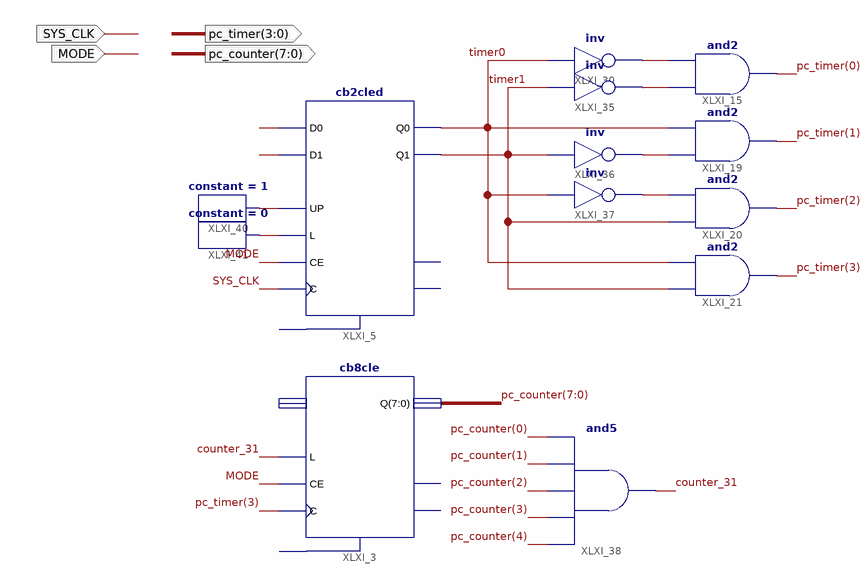
[diagram p0: schematic sheet 1]
// Xilinx ISE schematic programCounter.sch (spartan3e) as structural Verilog: 13 symbols, 4 ports
module programCounter (
  input  SYS_CLK,
  input  MODE,
  output [3:0] pc_timer,
  output [7:0] pc_counter
);

  wire counter_31, timer0, timer1, XLXN_8, XLXN_9, XLXN_11, XLXN_14, XLXN_81, XLXN_83, XLXN_85, XLXN_86;

  cb2cled XLXI_5 (
    .C(SYS_CLK), .CE(MODE), .D0(XLXN_8), .D1(XLXN_9), .L(XLXN_11), .UP(XLXN_14), .Q0(timer0), .Q1(timer1));  // open: CLR, CEO, TC
  cb8cle XLXI_3 (.C(pc_timer[3]), .CE(MODE), .L(counter_31), .Q(pc_counter));  // open: CLR, D, CEO, TC
  not XLXI_30 (XLXN_81, timer0);
  and XLXI_21 (pc_timer[3], timer1, timer0);
  and XLXI_20 (pc_timer[2], timer1, XLXN_86);
  and XLXI_19 (pc_timer[1], XLXN_85, timer0);
  and XLXI_15 (pc_timer[0], XLXN_83, XLXN_81);
  not XLXI_35 (XLXN_83, timer1);
  not XLXI_36 (XLXN_85, timer1);
  not XLXI_37 (XLXN_86, timer0);
  and XLXI_38 (counter_31, pc_counter[4], pc_counter[3], pc_counter[2], pc_counter[1], pc_counter[0]);
  constant #(.CValue("1")) XLXI_40 (.O(XLXN_14));
  constant #(.CValue("0")) XLXI_41 (.O(XLXN_11));
endmodule
